# Altium schematic sheet Nrf52Feather.SchDoc
size A3
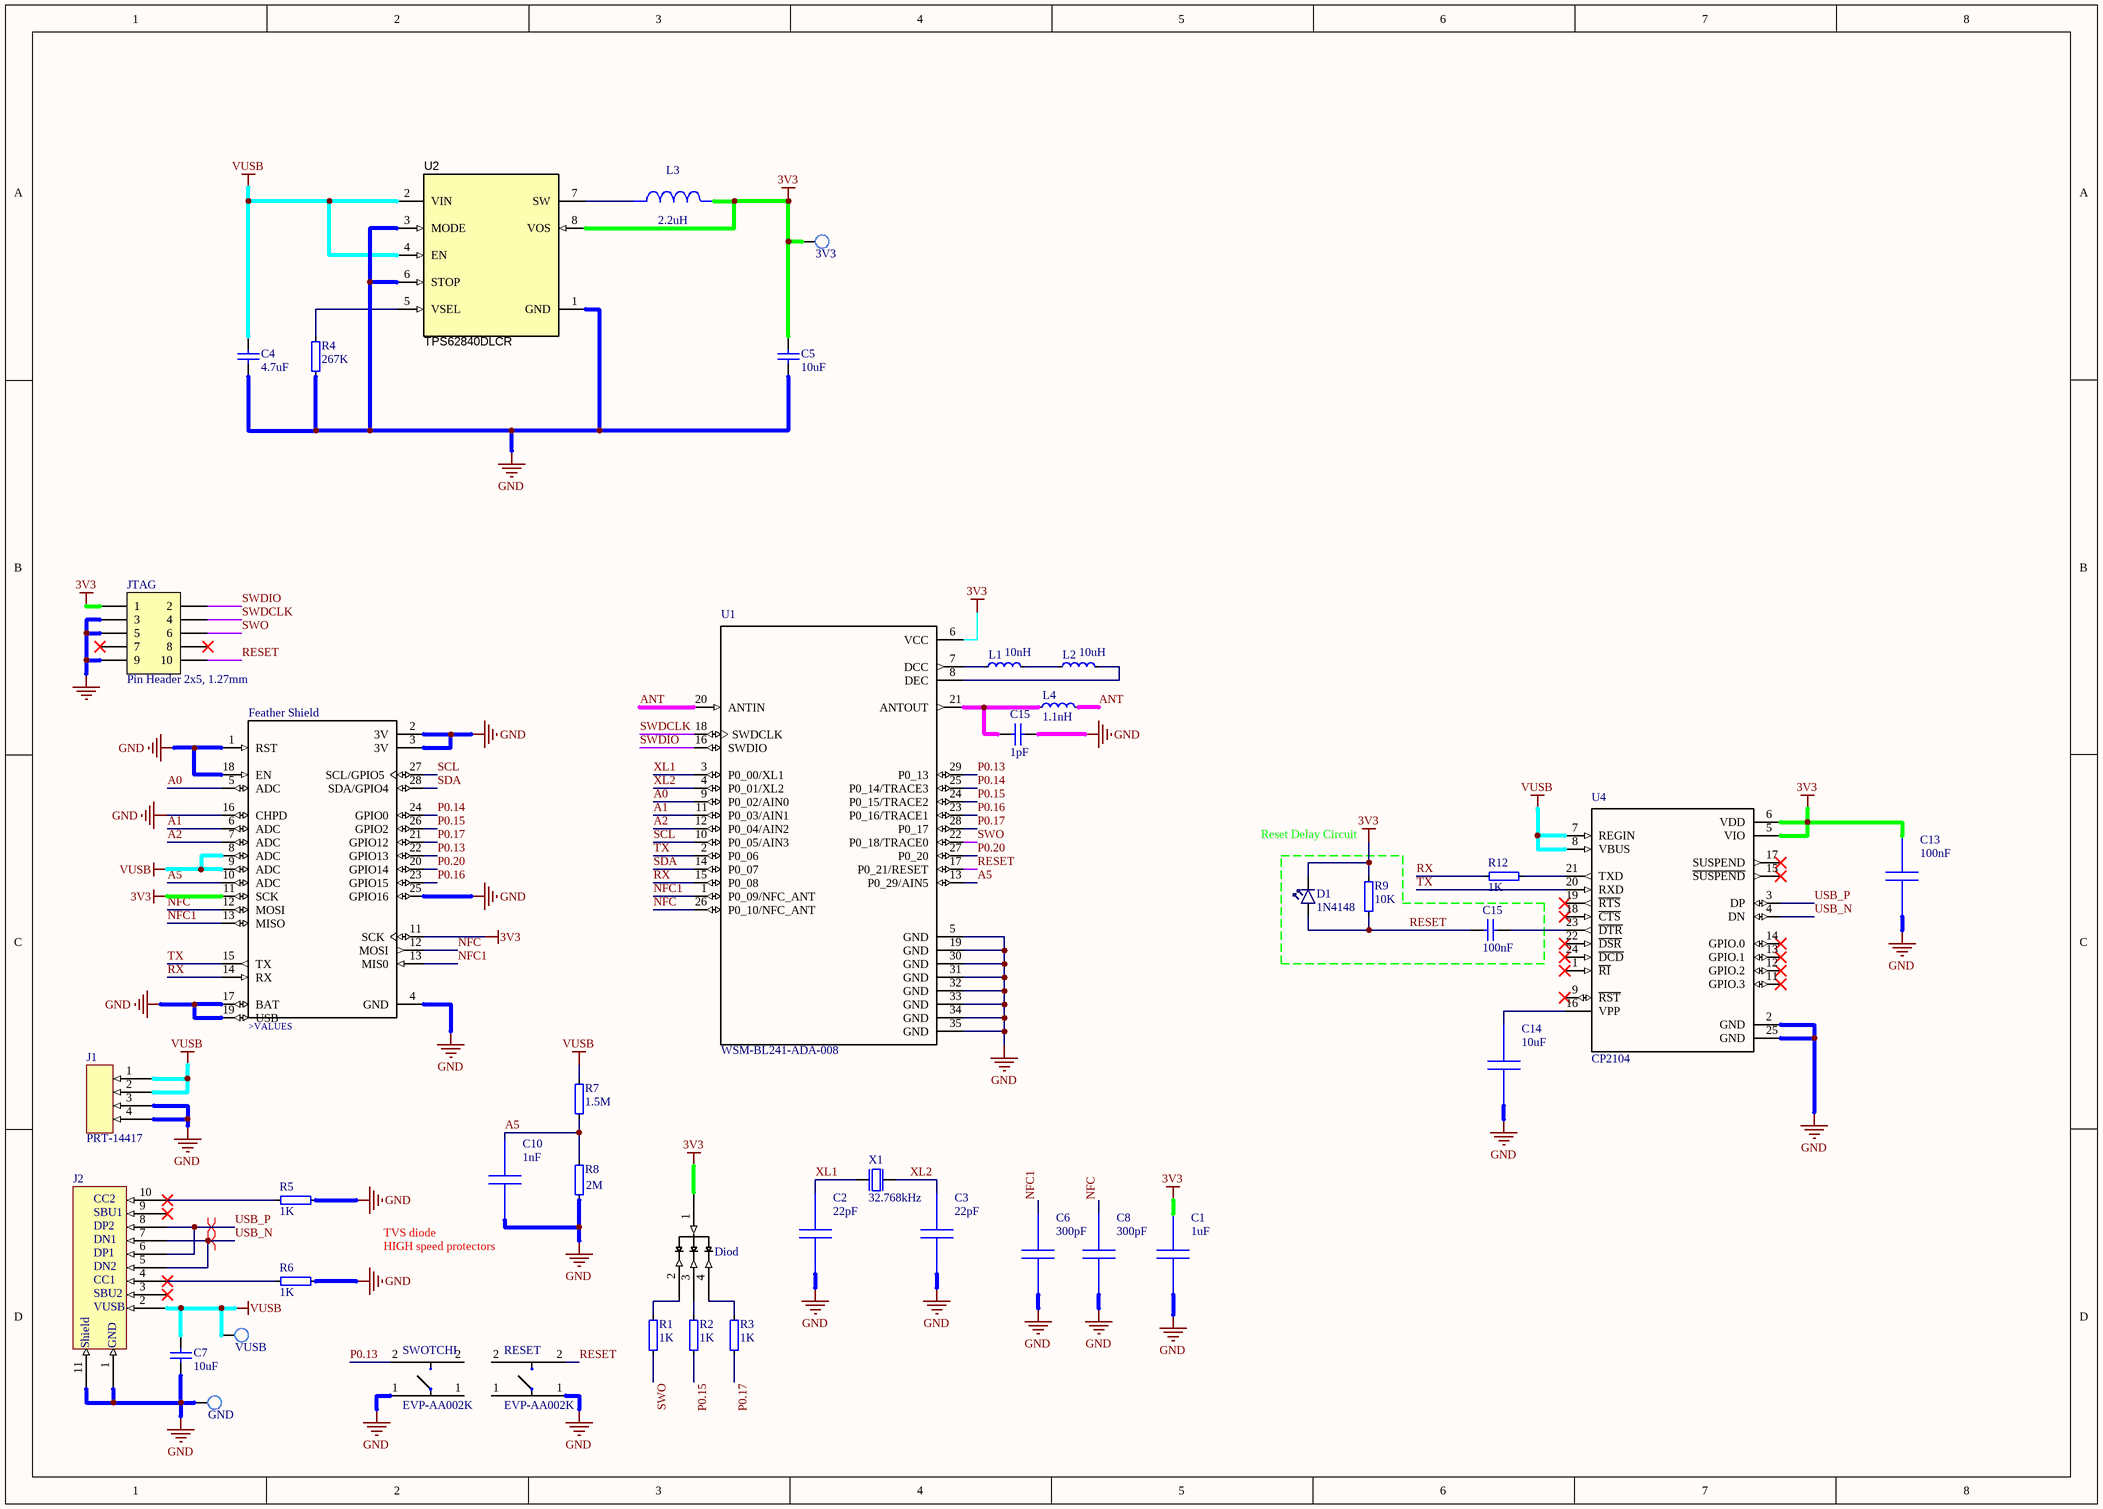
[diagram p0: Nrf52Feather.SchDoc]

## Parts
(Parts that share a designator on the sheet are numbered #1, #2 ... from top to bottom, then left to right.)
3V3  TP  [TP_SMD_Ø1.0mm]  (value not drawn)
C1  value 1uF  [0402]  (hidden comment: EMK107B7105KA-T)
C2  value 22pF  [0402]  (hidden comment: EMK107B7105KA-T)
C3  value 22pF  [0402]  (hidden comment: EMK107B7105KA-T)
C4  4.7uF  [C0603]
C5  10uF  [C0603]
C6  value 300pF  [0402]  (hidden comment: EMK107B7105KA-T)
C7  10uF  [C0603]
C8  value 300pF  [0402]  (hidden comment: EMK107B7105KA-T)
C10  value 1nF  [0402]  (hidden comment: EMK107B7105KA-T)
C13  value 100nF  [0402]  (hidden comment: EMK107B7105KA-T)
C14  value 10uF  [0402]  (hidden comment: EMK107B7105KA-T)
C15#1  1pF  [C0402]
C15#2  100nF  [C0402]
D1  1N4148  [LED_0603_G]
Diod  CLMVC-FKA-CLBDGL7LBB79353  [SmollLedCree]  (value not drawn)
Feather_Shield  2821  [*XCVR_2821]  (value not drawn)
GND  TP  [TP_SMD_Ø1.0mm]  (value not drawn)
J1  PRT-14417  [jst 1mm]
J2  USB-C  [TYPE-C-31-M-12]  (value not drawn)
JTAG  Pin Header 2x5, 1.27mm  [HDR_2x5-SMD-1.27mm-K]
L1  10nH  [IND0402]
L2  10uH  [IND0402]
L3  value 2.2uH  [IND0805R]  (hidden comment: DFE201612E-2R2M=P2)
L4  1.1nH  [IND0402]
R1  1K  [0402]
R2  1K  [0402]
R3  1K  [0402]
R4  267K  [RES0603R]
R5  1K  [RES0402]
R6  1K  [RES0402]
R7  1.5M  [0402]
R8  2M  [0402]
R9  10K  [RES0402]
R12  1K  [0402]
RESET  EVP-AA002K  [MiniSwitch]
SWOTCHI  EVP-AA002K  [MiniSwitch]
U1  WSM-BL241-ADA-008  [*MODULE_WSM-BL241-ADA-008]
U2  TPS62840DLCR  [TPS62840]
U4  CP2104  [*QFN50P400X400X80-25N]
VUSB  TP  [TP_SMD_Ø1.0mm]  (value not drawn)
X1  32.768kHz  [XTAL_3215]

## Nets
3V3: 3V3.1 C1.1 C5.2 C13.1 D1.1(C) Diod.1 Feather_Shield.11(SCK) JTAG.1 L3.1 R9.2 U1.6(VCC) U2.8(VOS) U4.5(VIO) U4.6(VDD)
GND: C1.2 C2.2 C3.2 C4.1 C5.1 C6.2 C7.1 C8.2 C10.2 C13.2 C14.2 C15#1.1 Feather_Shield.1(RST) Feather_Shield.2(3V) Feather_Shield.3(3V) Feather_Shield.4(GND) Feather_Shield.16(CHPD) Feather_Shield.17(BAT) Feather_Shield.18(EN) Feather_Shield.19(USB) Feather_Shield.25(GPIO16) GND.1 J1.3 J1.4 J2.1 J2.11 JTAG.3 JTAG.5 JTAG.9 R4.1 R5.1 R6.1 R8.1 RESET.1 SWOTCHI.1 U1.5(GND) U1.19(GND) U1.30(GND) U1.31(GND) U1.32(GND) U1.33(GND) U1.34(GND) U1.35(GND) U2.1(GND) U2.3(MODE) U2.6(STOP) U4.2(GND) U4.25(GND)
VUSB: C4.2 C7.2 Feather_Shield.8(ADC) Feather_Shield.9(ADC) J1.1 J1.2 J2.2 R7.2 U2.2(VIN) U2.4(EN) U4.7(REGIN) U4.8(VBUS) VUSB.1
A0: Feather_Shield.5(ADC) U1.9(P0_02/AIN0)
A1: Feather_Shield.6(ADC) U1.11(P0_03/AIN1)
A2: Feather_Shield.7(ADC) U1.12(P0_04/AIN2)
A5: C10.1 Feather_Shield.10(ADC) R7.1 R8.2 U1.13(P0_29/AIN5)
ANT: L4.2 U1.20(ANTIN)
NFC: C8.1 Feather_Shield.12(MOSI) U1.26(P0_10/NFC_ANT)
NFC1: C6.1 Feather_Shield.13(MIS0) U1.1(P0_09/NFC_ANT)
P0.13: Feather_Shield.22(GPIO13) SWOTCHI.2 U1.29(P0_13)
P0.14: Feather_Shield.24(GPIO0) U1.25(P0_14/TRACE3)
P0.15: Feather_Shield.26(GPIO2) R2.1 U1.24(P0_15/TRACE2)
P0.16: Feather_Shield.23(GPIO15) U1.23(P0_16/TRACE1)
P0.17: Feather_Shield.21(GPIO12) R3.1 U1.28(P0_17)
P0.20: Feather_Shield.20(GPIO14) U1.27(P0_20)
RESET: C15#2.2 D1.2(A) JTAG.10 R9.1 RESET.2 U1.17(P0_21/RESET)
RX: Feather_Shield.14(RX) R12.2 U1.15(P0_08)
SCL: Feather_Shield.27(SCL/GPIO5) U1.10(P0_05/AIN3)
SDA: Feather_Shield.28(SDA/GPIO4) U1.14(P0_07)
SWDCLK: JTAG.4 U1.18(SWDCLK)
SWDIO: JTAG.2 U1.16(SWDIO)
SWO: JTAG.6 R1.1 U1.22(P0_18/TRACE0)
TX: Feather_Shield.15(TX) U1.2(P0_06) U4.20(RXD)
USB_N: J2.5 J2.7 U4.4(DN)
USB_P: J2.6 J2.8 U4.3(DP)
XL1: C2.1 U1.3(P0_00/XL1) X1.1(inp)
XL2: C3.1 U1.4(P0_01/XL2) X1.2(out)
NetC14_1: C14.1 U4.16(VPP)
NetC15#1_2: C15#1.2 L4.1 U1.21(ANTOUT)
NetC15#2_1: C15#2.1 U4.23(~{DTR})
NetDiod_2: Diod.2(Blue) R1.2
NetDiod_3: Diod.3 R2.2
NetDiod_4: Diod.4 R3.2
NetJ2_4: J2.4 R6.2
NetJ2_10: J2.10 R5.2
NetL1_1: L1.1 U1.7(DCC)
NetL1_2: L1.2 L2.1
NetL2_2: L2.2 U1.8(DEC)
NetL3_2: L3.2 U2.7(SW)
NetR4_2: R4.2 U2.5(VSEL)
NetR12_1: R12.1 U4.21(TXD)

Not connected (* = marked no-connect by the designer): J2 3* 9*; JTAG 7* 8*; U4 1(~{RI})* 9(~{RST})* 11(GPIO.3)* 12(GPIO.2)* 13(GPIO.1)* 14(GPIO.0)* 15(~{SUSPEND})* 17(SUSPEND)* 18(~{CTS})* 19(~{RTS})* 22(~{DSR})* 24(~{DCD})*

## Layout directives
differential pair: USB_P

## Notes on the sheet
- Reset Delay Circuit
- TVS diode
- (near C10) HIGH speed protectors
- (in symbol 2821) >VALUES
- (in symbol USB-C) CC2; SBU1; DP2; DN1; DP1; DN2; CC1; SBU2; VUSB; Shield; GND

## Library data of the parts
C1-C3 C6 C8 C10 C13 C14 = Cvcc_2: Manufacturer Name: Taiyo Yuden; PackageReference: EMK107B7105KA-T; Manufacturer Part Number: EMK107B7105KA-T
C4 C5 C7 C15#1 C15#2 = CAP: Capacitor; Value: 100pF; Published: 8-Jun-2000; Revision: July-2002: Re-released for DXP Platform.; Publisher: Altium Limited
D1 = D:LED: LED, Green, 0603, 570nm, Vf=1.7V, 2.24..5.6mcd, - 40 to +100°C; Part Number: LG L29K Smartled Green; Manufacturer: Osram; Manufacturer Part Number: LG L29K-G2J1-24-Z; Part number IPS: N.A.; Value: L0603G; Note: 2.24..5.6 mcd, Vfmin=1.7V; Artikkelnr Noca: 13019147; Footprint Doc: 0603; LatestRevisionDate: 2017-08-21; Pin Count: 2; Publisher: Nordic Semiconductor; Published: 2014-10-28; ComponentLink1URL: *; ComponentLink1Description: Datasheet; ComponentLink2URL: *; ComponentLink2Description: Supplier link; HelpURL: http://www.osram-os.com/Graphics/XPic2/00077107_0.pdf; Supplier 1: Digi-Key; Supplier Part Number 1: 475-2709-1-ND; Supplier 2: Mouser; Supplier Part Number 2: 720-LGL29KG2J124Z
Diod = SmollCree: 1. common anode 2. blue 3. green 4. red; ComponentLink1Description: Mouser; ComponentLink1URL: https://no.mouser.com/ProductDetail/Cree-Inc/CLMVC-FKA-CLBDGL7LBB79353?qs=fSnNYG2PaKLnACIKsEWrKA%3D%3D
Feather_Shield = 2821: Adafruit Feather HUZZAH with ESP8266 WiFi; MF: Adafruit Industries; Price: None; Package: None; Availability: Unavailable; SnapEDA_Link: https://www.snapeda.com/parts/2821/Adafruit%20Industries%20LLC/view-part/?ref=snap; MP: 2821; Value: *
J1 = JST 1mm: PRT-14417, jst sh 1mm 4 pin
JTAG = Pin Header 2x5 SMD, 1.27mm, KS: Pin Header 2x5, 1.27mm (50mil), SMD, Keying Shroud; Manufacturer: W-CON; Manufacturer Part Number: 3132-10MS0BK00R1; Part number IPS: N.A.; Artikkelnr Noca: 55010009; Part Number: Pin Header 2x5 SMD, 1.27mm, KS; Footprint Doc: HDR_2x5-SMD-1.27mm; LatestRevisionDate: 2016-04-21; Pin Count: 10; Publisher: Nordic Semiconductor; Published: 2016-01-22; Value: Pin Header 2x5, 1.27mm; Note: *; ComponentLink1URL: *; ComponentLink1Description: Datasheet; ComponentLink2URL: *; ComponentLink2Description: Supplier link; HelpURL: \\hizz\pro\app9717\Datasheet\connectores\W-CON\3132-XXMXXBK00XX.pdf; Supplier 1: Cabcon; Supplier Part Number 1: 3132-10MS0BK00R1; Supplier 2: Samtec; Supplier Part Number 2: FTSH-105-01-F-DV-K
L1 L2 L4 = IND: Inductor; Part Number: FB0402-120R@100M-500mA; Manufacturer: Murata; Manufacturer Part Number: BLM15AG121SN1D; Part number IPS: N.A.; Value: 120R/0.55A; Note: Chip EMIFIL Inductor Type Chip Ferrite Bead; Artikkelnr Noca: 33029317; Footprint Doc: 0402; LatestRevisionDate: 2014-01-10; Pin Count: 2; Publisher: Nordic Semiconductor; Published: 2011-11-14; ComponentLink1URL: *; ComponentLink1Description: Datasheet; ComponentLink2URL: *; ComponentLink2Description: Supplier link; HelpURL: http://search.murata.co.jp/Ceramy/image/img/PDF/ENG/L0110S0100BLM15A_SN.pdf; Supplier 1: Digi-Key; Supplier Part Number 1: 490-1005-1-ND; Supplier 2: Farnell; Supplier Part Number 2: 151-5760
L3 = DFE201612E-2R2M=P2: DFE201612E-2R2M=; Manufacturer Name: MuRata; PackageReference: DFE201612E-2R2M=P2; Manufacturer Part Number: DFE201612E-2R2M=P2
R1-R3 R7 R8 R12 = RES_1: Resistor, ±5%, 0.05W; Part Number: R0201-0R; Part number IPS: 00000003245; Value: 0R; Note: Chip Res 5%; Artikkelnr Noca: N.A.; Manufacturer: *; Manufacturer Part Number: *; ComponentLink1URL: *; ComponentLink1Description: Datasheet; ComponentLink2URL: *; ComponentLink2Description: Supplier link; HelpURL: *; Footprint Doc: 0201; LatestRevisionDate: 2017-11-09; Pin Count: 2; Publisher: Nordic Semiconductor; Published: 2014-11-13; Supplier 1: *; Supplier Part Number 1: *; Supplier 2: *; Supplier Part Number 2: *
R4-R6 R9 = RES: Resistor, ±5%, 0.05W; Part Number: R0201-0R; Part number IPS: 00000003245; Value: 0R; Note: Chip Res 5%; Artikkelnr Noca: N.A.; Manufacturer: *; Manufacturer Part Number: *; ComponentLink1URL: *; ComponentLink1Description: Datasheet; ComponentLink2URL: *; ComponentLink2Description: Supplier link; HelpURL: *; Footprint Doc: 0201; LatestRevisionDate: 2017-11-09; Pin Count: 2; Publisher: Nordic Semiconductor; Published: 2014-11-13; Supplier 1: *; Supplier Part Number 1: *; Supplier 2: *; Supplier Part Number 2: *
RESET SWOTCHI = SwitchMini: EVPAA002K = 1.0 N, EVPAAU02Q = 7.0 N
U1 = WSM-BL241-ADA-008: Bluetooth Low Energy/NFC module 1Mbps LGA; MF: Murata Electronics; Price: None; SnapEDA_Link: https://www.snapeda.com/parts/WSM-BL241-ADA-008/Murata%20Electronics%20North%20America/view-part/?ref=snap; Availability: Unavailable; Package: Module Murata; MP: WSM-BL241-ADA-008; Value: *
U2 = TPS62840: Ultra low IQ Step Down Converter, DLC0008A (VSON-HR-8); Alternate Manufacturer: Texas Instruments; SizeAreaWB_mm2: 7.5; SizeZ_mm: 1; SizeX_mm: 1.5; SizeY_mm: 2; SizeArea_mm2: 3; CompType: IC; AEC Qualified: N; AEC Category: Q200; ComponentLink1URL: http://www.ti.com/lit/ds/symlink/tps62840.pdf; PackageDescription: VSON-HR-8; MountType: SMT; ComponentLink2URL: http://www.ti.com/product/tps62840; ComponentLink3Description: Online Datasheet; ComponentLink2Description: Product Folder; Manufacturer: Texas Instruments; ComponentLink3URL: http://www.ti.com/product/tps62840/datasheet; PackageReference: DLC0008A; ComponentLink1Description: Datasheet Link; Operating Temperature Range: -40 to 125 C; PartNumber: TPS62840DLCR
U4 = CP2104: USB to UART Bridge; MF: Silicon Labs; Price: None; MP: CP2104; SnapEDA_Link: https://www.snapeda.com/parts/CP2104/Silicon%20Labs/view-part/?ref=snap; Package: QFN-24 Silicon Labs; Availability: Unavailable; Value: *
X1 = XTAL_2-pin: XTAL SMD 3215, 32.768kHz, 9pF, ±20ppm; Part Number: XTAL_SMD3215_32.768kHz_9pF_NDK; Manufacturer: NDK; Manufacturer Part Number: NX3215SA-32.768K-STD-MUA-9; Part number IPS: N.A.; Note: XTAL SMD 32.768kHz; Artikkelnr Noca: 22010049; LatestRevisionDate: 2017-10-23; Pin Count: 2; Publisher: Nordic Semiconductor; Published: 2017-10-23; Value: 32.768kHz; Footprint Doc: XTAL_3215; ComponentLink1URL: *; ComponentLink1Description: Datasheet; ComponentLink2URL: *; ComponentLink2Description: Supplier link; HelpURL: *; Supplier 1: *; Supplier Part Number 1: *; Supplier 2: *; Supplier Part Number 2: *